# Altium schematic sheet AM3359_B.SchDoc
size A2
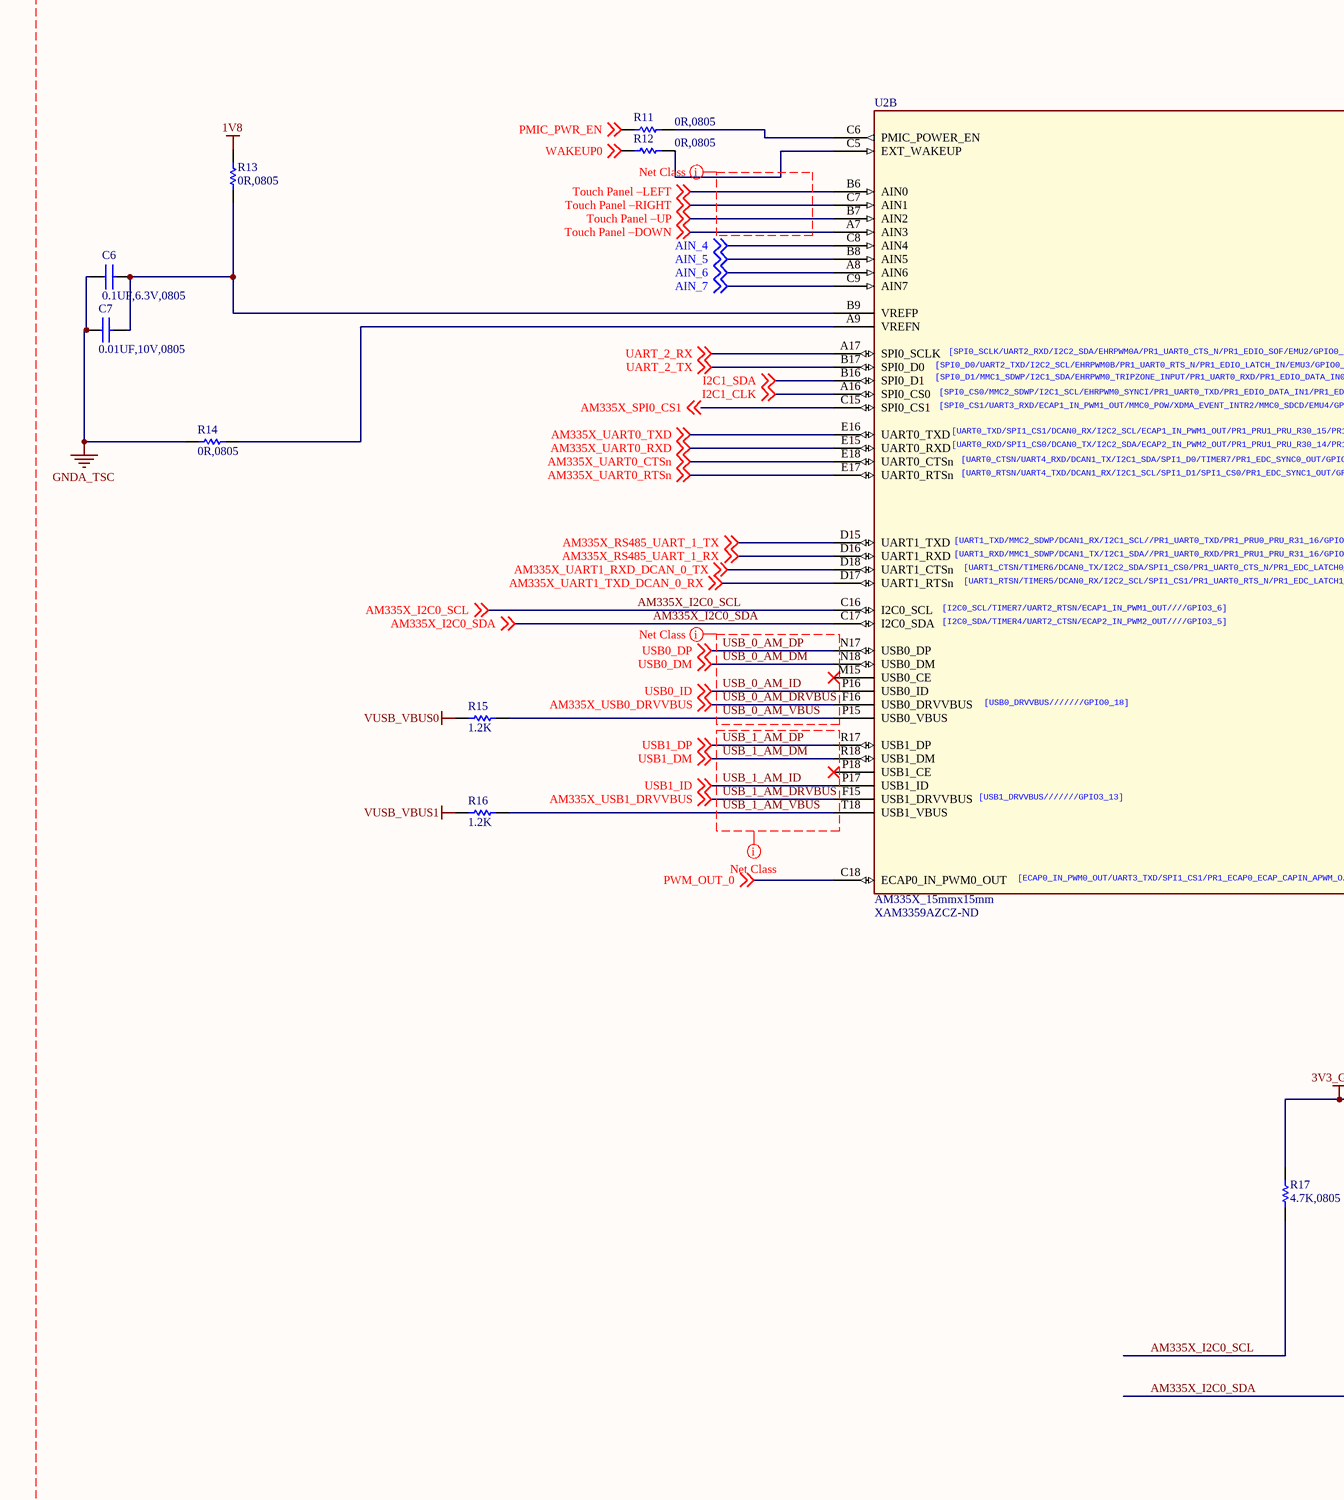
[diagram p0: AM3359_B.SchDoc, left]
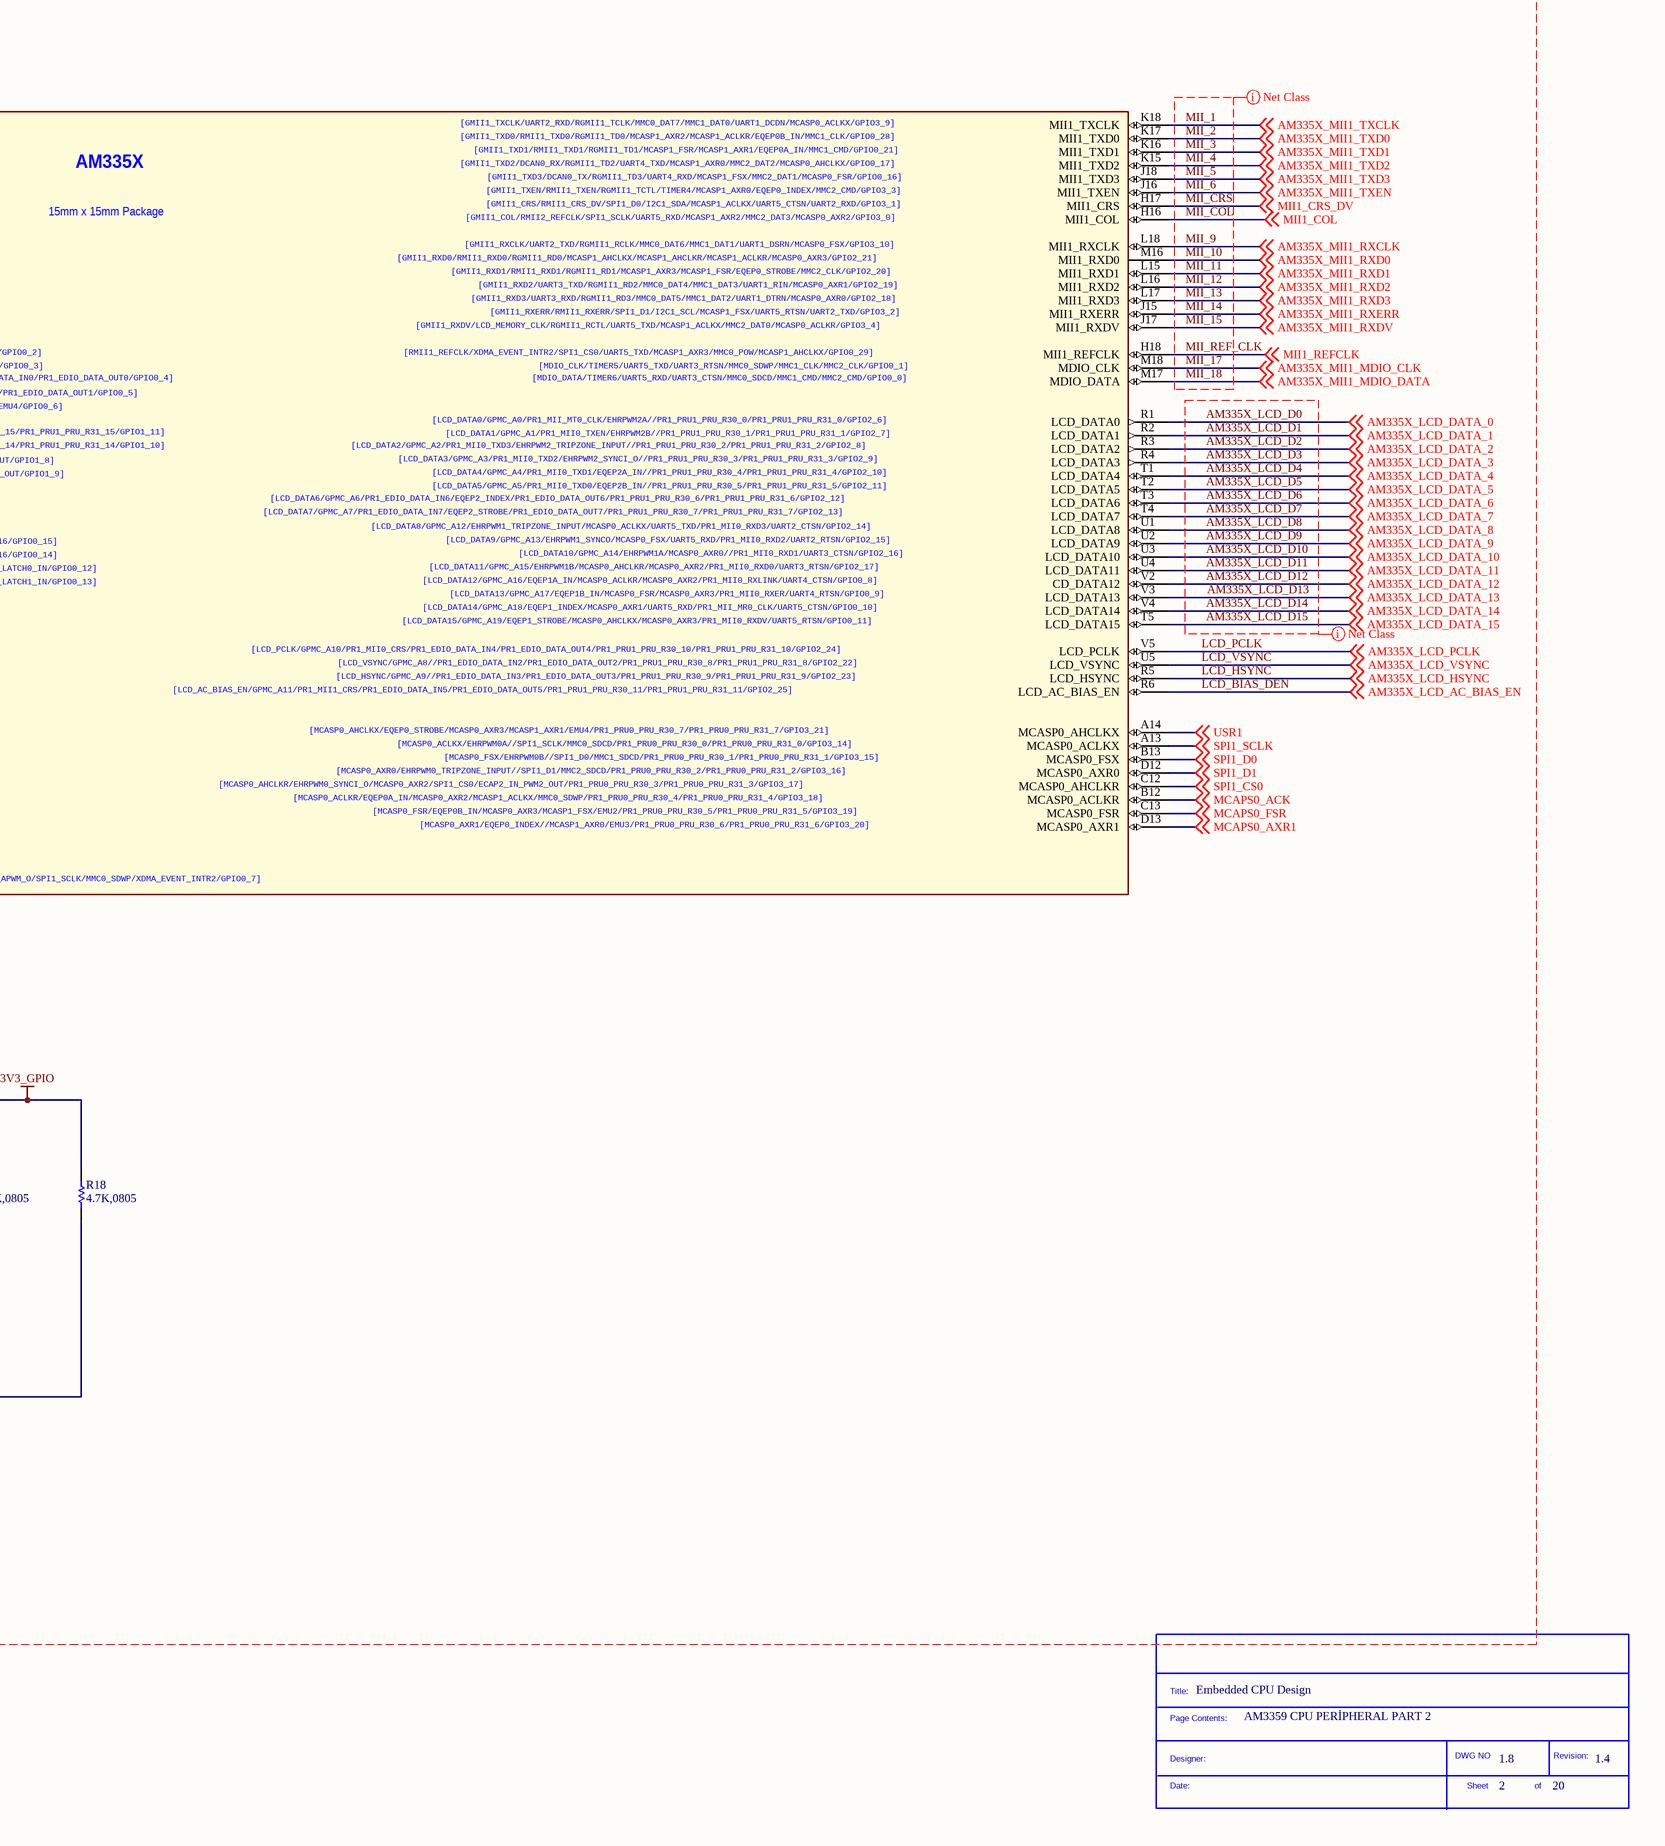
[diagram p1: AM3359_B.SchDoc, right]

## Parts
*?  SDTitleBlock  (value not drawn)  (graphical)
C6  0.1UF,6.3V,0805  [0402]
C7  0.01UF,10V,0805  [0402]
R11  0R,0805  [0402]
R12  0R,0805  [0402]
R13  0R,0805  [0402]
R14  0R,0805  [0402]
R15  1.2K  [0402]
R16  1.2K  [0402]
R17  4.7K,0805  [0402]
R18  4.7K,0805  [0402]
U2  AM335X_15mmx15mm  Supplier Part Number 1: XAM3359AZCZ-ND  [am33xx_15x15]  (part B of 3)

## Nets
1V8: R13.2
3V3_GPIO: R17.2 R18.2
GNDA_TSC: C6.1 C7.1 R14.2
VUSB_VBUS0: R15.1
VUSB_VBUS1: R16.1
AIN_4: U2.C8(AIN4) ; off-sheet AIN_4
AIN_5: U2.B8(AIN5) ; off-sheet AIN_5
AIN_6: U2.A8(AIN6) ; off-sheet AIN_6
AIN_7: U2.C9(AIN7) ; off-sheet AIN_7
AM335X_I2C0_SCL: R17.1 U2.C16(I2C0_SCL) ; off-sheet AM335X_I2C0_SCL
AM335X_I2C0_SDA: R18.1 U2.C17(I2C0_SDA) ; off-sheet AM335X_I2C0_SDA
AM335X_LCD_D0: U2.R1(LCD_DATA0) ; off-sheet AM335X_LCD_DATA_0  [also labelled AM335X_LCD_DATA_0]
AM335X_LCD_D1: U2.R2(LCD_DATA1) ; off-sheet AM335X_LCD_DATA_1  [also labelled AM335X_LCD_DATA_1]
AM335X_LCD_D2: U2.R3(LCD_DATA2) ; off-sheet AM335X_LCD_DATA_2  [also labelled AM335X_LCD_DATA_2]
AM335X_LCD_D3: U2.R4(LCD_DATA3) ; off-sheet AM335X_LCD_DATA_3  [also labelled AM335X_LCD_DATA_3]
AM335X_LCD_D4: U2.T1(LCD_DATA4) ; off-sheet AM335X_LCD_DATA_4  [also labelled AM335X_LCD_DATA_4]
AM335X_LCD_D5: U2.T2(LCD_DATA5) ; off-sheet AM335X_LCD_DATA_5  [also labelled AM335X_LCD_DATA_5]
AM335X_LCD_D6: U2.T3(LCD_DATA6) ; off-sheet AM335X_LCD_DATA_6  [also labelled AM335X_LCD_DATA_6]
AM335X_LCD_D7: U2.T4(LCD_DATA7) ; off-sheet AM335X_LCD_DATA_7  [also labelled AM335X_LCD_DATA_7]
AM335X_LCD_D8: U2.U1(LCD_DATA8) ; off-sheet AM335X_LCD_DATA_8  [also labelled AM335X_LCD_DATA_8]
AM335X_LCD_D9: U2.U2(LCD_DATA9) ; off-sheet AM335X_LCD_DATA_9  [also labelled AM335X_LCD_DATA_9]
AM335X_LCD_D10: U2.U3(LCD_DATA10) ; off-sheet AM335X_LCD_DATA_10  [also labelled AM335X_LCD_DATA_10]
AM335X_LCD_D11: U2.U4(LCD_DATA11) ; off-sheet AM335X_LCD_DATA_11  [also labelled AM335X_LCD_DATA_11]
AM335X_LCD_D12: U2.V2(CD_DATA12) ; off-sheet AM335X_LCD_DATA_12  [also labelled AM335X_LCD_DATA_12]
AM335X_LCD_D13: U2.V3(LCD_DATA13) ; off-sheet AM335X_LCD_DATA_13  [also labelled AM335X_LCD_DATA_13]
AM335X_LCD_D14: U2.V4(LCD_DATA14) ; off-sheet AM335X_LCD_DATA_14  [also labelled AM335X_LCD_DATA_14]
AM335X_LCD_D15: U2.T5(LCD_DATA15) ; off-sheet AM335X_LCD_DATA_15  [also labelled AM335X_LCD_DATA_15]
AM335X_RS485_UART_1_RX: U2.D16(UART1_RXD) ; off-sheet AM335X_RS485_UART_1_RX
AM335X_RS485_UART_1_TX: U2.D15(UART1_TXD) ; off-sheet AM335X_RS485_UART_1_TX
AM335X_SPI0_CS1: U2.C15(SPI0_CS1) ; off-sheet AM335X_SPI0_CS1
AM335X_UART0_CTSn: U2.E18(UART0_CTSn) ; off-sheet AM335X_UART0_CTSn
AM335X_UART0_RTSn: U2.E17(UART0_RTSn) ; off-sheet AM335X_UART0_RTSn
AM335X_UART0_RXD: U2.E15(UART0_RXD) ; off-sheet AM335X_UART0_RXD
AM335X_UART0_TXD: U2.E16(UART0_TXD) ; off-sheet AM335X_UART0_TXD
AM335X_UART1_RXD_DCAN_0_TX: U2.D18(UART1_CTSn) ; off-sheet AM335X_UART1_RXD_DCAN_0_TX
AM335X_UART1_TXD_DCAN_0_RX: U2.D17(UART1_RTSn) ; off-sheet AM335X_UART1_TXD_DCAN_0_RX
I2C1_CLK: U2.A16(SPI0_CS0) ; off-sheet I2C1_CLK
I2C1_SDA: U2.B16(SPI0_D1) ; off-sheet I2C1_SDA
LCD_BIAS_DEN: U2.R6(LCD_AC_BIAS_EN) ; off-sheet AM335X_LCD_AC_BIAS_EN  [also labelled AM335X_LCD_AC_BIAS_EN]
LCD_HSYNC: U2.R5(LCD_HSYNC) ; off-sheet AM335X_LCD_HSYNC  [also labelled AM335X_LCD_HSYNC]
LCD_PCLK: U2.V5(LCD_PCLK) ; off-sheet AM335X_LCD_PCLK  [also labelled AM335X_LCD_PCLK]
LCD_VSYNC: U2.U5(LCD_VSYNC) ; off-sheet AM335X_LCD_VSYNC  [also labelled AM335X_LCD_VSYNC]
MCAPS0_ACK: U2.B12(MCASP0_ACLKR) ; off-sheet MCAPS0_ACK
MCAPS0_AXR1: U2.D13(MCASP0_AXR1) ; off-sheet MCAPS0_AXR1
MCAPS0_FSR: U2.C13(MCASP0_FSR) ; off-sheet MCAPS0_FSR
MII_1: U2.K18(MII1_TXCLK) ; off-sheet AM335X_MII1_TXCLK  [also labelled AM335X_MII1_TXCLK]
MII_2: U2.K17(MII1_TXD0) ; off-sheet AM335X_MII1_TXD0  [also labelled AM335X_MII1_TXD0]
MII_3: U2.K16(MII1_TXD1) ; off-sheet AM335X_MII1_TXD1  [also labelled AM335X_MII1_TXD1]
MII_4: U2.K15(MII1_TXD2) ; off-sheet AM335X_MII1_TXD2  [also labelled AM335X_MII1_TXD2]
MII_5: U2.J18(MII1_TXD3) ; off-sheet AM335X_MII1_TXD3  [also labelled AM335X_MII1_TXD3]
MII_6: U2.J16(MII1_TXEN) ; off-sheet AM335X_MII1_TXEN  [also labelled AM335X_MII1_TXEN]
MII_9: U2.L18(MII1_RXCLK) ; off-sheet AM335X_MII1_RXCLK  [also labelled AM335X_MII1_RXCLK]
MII_10: U2.M16(MII1_RXD0) ; off-sheet AM335X_MII1_RXD0  [also labelled AM335X_MII1_RXD0]
MII_11: U2.L15(MII1_RXD1) ; off-sheet AM335X_MII1_RXD1  [also labelled AM335X_MII1_RXD1]
MII_12: U2.L16(MII1_RXD2) ; off-sheet AM335X_MII1_RXD2  [also labelled AM335X_MII1_RXD2]
MII_13: U2.L17(MII1_RXD3) ; off-sheet AM335X_MII1_RXD3  [also labelled AM335X_MII1_RXD3]
MII_14: U2.J15(MII1_RXERR) ; off-sheet AM335X_MII1_RXERR  [also labelled AM335X_MII1_RXERR]
MII_15: U2.J17(MII1_RXDV) ; off-sheet AM335X_MII1_RXDV  [also labelled AM335X_MII1_RXDV]
MII_17: U2.M18(MDIO_CLK) ; off-sheet AM335X_MII1_MDIO_CLK  [also labelled AM335X_MII1_MDIO_CLK]
MII_18: U2.M17(MDIO_DATA) ; off-sheet AM335X_MII1_MDIO_DATA  [also labelled AM335X_MII1_MDIO_DATA]
MII_COL: U2.H16(MII1_COL) ; off-sheet MII1_COL  [also labelled MII1_COL]
MII_CRS: U2.H17(MII1_CRS) ; off-sheet MII1_CRS_DV  [also labelled MII1_CRS_DV]
MII_REF_CLK: U2.H18(MII1_REFCLK) ; off-sheet MII1_REFCLK  [also labelled MII1_REFCLK]
PMIC_PWR_EN: R11.1 ; off-sheet PMIC_PWR_EN
PWM_OUT_0: U2.C18(ECAP0_IN_PWM0_OUT) ; off-sheet PWM_OUT_0
SPI1_CS0: U2.C12(MCASP0_AHCLKR) ; off-sheet SPI1_CS0
SPI1_D0: U2.B13(MCASP0_FSX) ; off-sheet SPI1_D0
SPI1_D1: U2.D12(MCASP0_AXR0) ; off-sheet SPI1_D1
SPI1_SCLK: U2.A13(MCASP0_ACLKX) ; off-sheet SPI1_SCLK
Touch Panel –DOWN: U2.A7(AIN3) ; off-sheet Touch Panel –DOWN
Touch Panel –LEFT: U2.B6(AIN0) ; off-sheet Touch Panel –LEFT
Touch Panel –RIGHT: U2.C7(AIN1) ; off-sheet Touch Panel –RIGHT
Touch Panel –UP: U2.B7(AIN2) ; off-sheet Touch Panel –UP
UART_2_RX: U2.A17(SPI0_SCLK) ; off-sheet UART_2_RX
UART_2_TX: U2.B17(SPI0_D0) ; off-sheet UART_2_TX
USB_0_AM_DM: U2.N18(USB0_DM) ; off-sheet USB0_DM  [also labelled USB0_DM]
USB_0_AM_DP: U2.N17(USB0_DP) ; off-sheet USB0_DP  [also labelled USB0_DP]
USB_0_AM_DRVBUS: U2.F16(USB0_DRVVBUS) ; off-sheet AM335X_USB0_DRVVBUS  [also labelled AM335X_USB0_DRVVBUS]
USB_0_AM_ID: U2.P16(USB0_ID) ; off-sheet USB0_ID  [also labelled USB0_ID]
USB_0_AM_VBUS: R15.2 U2.P15(USB0_VBUS)
USB_1_AM_DM: U2.R18(USB1_DM) ; off-sheet USB1_DM  [also labelled USB1_DM]
USB_1_AM_DP: U2.R17(USB1_DP) ; off-sheet USB1_DP  [also labelled USB1_DP]
USB_1_AM_DRVBUS: U2.F15(USB1_DRVVBUS) ; off-sheet AM335X_USB1_DRVVBUS  [also labelled AM335X_USB1_DRVVBUS]
USB_1_AM_ID: U2.P17(USB1_ID) ; off-sheet USB1_ID  [also labelled USB1_ID]
USB_1_AM_VBUS: R16.2 U2.T18(USB1_VBUS)
USR1: U2.A14(MCASP0_AHCLKX) ; off-sheet USR1
WAKEUP0: R12.1 ; off-sheet WAKEUP0
NetC6_2: C6.2 C7.2 R13.1 U2.B9(VREFP)
NetR11_2: R11.2 U2.C6(PMIC_POWER_EN)
NetR12_2: R12.2 U2.C5(EXT_WAKEUP)
NetR14_1: R14.1 U2.A9(VREFN)

Not connected (* = marked no-connect by the designer): U2 M15(USB0_CE)* P18(USB1_CE)*

## Layout directives
net class LCD_1: AM335X_LCD_D0, AM335X_LCD_D1, AM335X_LCD_D2, AM335X_LCD_D3, AM335X_LCD_D4, AM335X_LCD_D5, AM335X_LCD_D6, AM335X_LCD_D7, AM335X_LCD_D8, AM335X_LCD_D9, AM335X_LCD_D10, AM335X_LCD_D11, AM335X_LCD_D12, AM335X_LCD_D13, AM335X_LCD_D14, AM335X_LCD_D15
net class MII: MII_1, MII_2, MII_3, MII_4, MII_5, MII_6, MII_9, MII_10, MII_11, MII_12, MII_13, MII_14, MII_15, MII_17, MII_18, MII_COL, MII_CRS, MII_REF_CLK
net class AM335X_B: 1V8, 3V3_GPIO, AIN_4, AIN_5, AIN_6, AIN_7, AM335X_I2C0_SCL, AM335X_I2C0_SDA, AM335X_LCD_AC_BIAS_EN, AM335X_LCD_D0, AM335X_LCD_D1, AM335X_LCD_D2, AM335X_LCD_D3, AM335X_LCD_D4, AM335X_LCD_D5, AM335X_LCD_D6, AM335X_LCD_D7, AM335X_LCD_D8, AM335X_LCD_D9, AM335X_LCD_D10, AM335X_LCD_D11, AM335X_LCD_D12, AM335X_LCD_D13, AM335X_LCD_D14, AM335X_LCD_D15, AM335X_LCD_DATA_0, AM335X_LCD_DATA_1, AM335X_LCD_DATA_2, AM335X_LCD_DATA_3, AM335X_LCD_DATA_4, AM335X_LCD_DATA_5, AM335X_LCD_DATA_6, AM335X_LCD_DATA_7, AM335X_LCD_DATA_8, AM335X_LCD_DATA_9, AM335X_LCD_DATA_10, AM335X_LCD_DATA_11, AM335X_LCD_DATA_12, AM335X_LCD_DATA_13, AM335X_LCD_DATA_14, AM335X_LCD_DATA_15, AM335X_LCD_HSYNC, AM335X_LCD_PCLK, AM335X_LCD_VSYNC, AM335X_MII1_MDIO_CLK, AM335X_MII1_MDIO_DATA, AM335X_MII1_RXCLK, AM335X_MII1_RXD0, AM335X_MII1_RXD1, AM335X_MII1_RXD2, AM335X_MII1_RXD3, AM335X_MII1_RXDV, AM335X_MII1_RXERR, AM335X_MII1_TXCLK, AM335X_MII1_TXD0, AM335X_MII1_TXD1, AM335X_MII1_TXD2, AM335X_MII1_TXD3, AM335X_MII1_TXEN, AM335X_RS485_UART_1_RX, AM335X_RS485_UART_1_TX, AM335X_SPI0_CS1, AM335X_UART0_CTSn, AM335X_UART0_RTSn, AM335X_UART0_RXD, AM335X_UART0_TXD, AM335X_UART1_RXD_DCAN_0_TX, AM335X_UART1_TXD_DCAN_0_RX, AM335X_USB0_DRVVBUS, AM335X_USB1_DRVVBUS, GNDA_TSC, I2C1_CLK, I2C1_SDA, LCD_BIAS_DEN, LCD_HSYNC, LCD_PCLK, LCD_VSYNC, MCAPS0_ACK, MCAPS0_AXR1, MCAPS0_FSR, MII1_COL, MII1_CRS_DV, MII1_REFCLK, MII_1, MII_2, MII_3, MII_4, MII_5, MII_6, MII_9, MII_10, MII_11, MII_12, MII_13, MII_14, MII_15, MII_17, MII_18, MII_COL, MII_CRS, MII_REF_CLK, PMIC_PWR_EN, PWM_OUT_0, SPI1_CS0, SPI1_D0, SPI1_D1, SPI1_SCLK, Touch Panel –DOWN, Touch Panel –LEFT, Touch Panel –RIGHT, Touch Panel –UP, UART_2_RX, UART_2_TX, USB0_DM, USB0_DP, USB0_ID, USB1_DM, USB1_DP, USB1_ID, USB_0_AM_DM, USB_0_AM_DP, USB_0_AM_DRVBUS, USB_0_AM_ID, USB_0_AM_VBUS, USB_1_AM_DM, USB_1_AM_DP, USB_1_AM_DRVBUS, USB_1_AM_ID, USB_1_AM_VBUS, USR1, VUSB_VBUS0, VUSB_VBUS1, WAKEUP0
net class USB_0_AMX: 1V8, 3V3_GPIO, AIN_4, AIN_5, AIN_6, AIN_7, AM335X_I2C0_SCL, AM335X_I2C0_SDA, AM335X_LCD_AC_BIAS_EN, AM335X_LCD_D0, AM335X_LCD_D1, AM335X_LCD_D2, AM335X_LCD_D3, AM335X_LCD_D4, AM335X_LCD_D5, AM335X_LCD_D6, AM335X_LCD_D7, AM335X_LCD_D8, AM335X_LCD_D9, AM335X_LCD_D10, AM335X_LCD_D11, AM335X_LCD_D12, AM335X_LCD_D13, AM335X_LCD_D14, AM335X_LCD_D15, AM335X_LCD_DATA_0, AM335X_LCD_DATA_1, AM335X_LCD_DATA_2, AM335X_LCD_DATA_3, AM335X_LCD_DATA_4, AM335X_LCD_DATA_5, AM335X_LCD_DATA_6, AM335X_LCD_DATA_7, AM335X_LCD_DATA_8, AM335X_LCD_DATA_9, AM335X_LCD_DATA_10, AM335X_LCD_DATA_11, AM335X_LCD_DATA_12, AM335X_LCD_DATA_13, AM335X_LCD_DATA_14, AM335X_LCD_DATA_15, AM335X_LCD_HSYNC, AM335X_LCD_PCLK, AM335X_LCD_VSYNC, AM335X_MII1_MDIO_CLK, AM335X_MII1_MDIO_DATA, AM335X_MII1_RXCLK, AM335X_MII1_RXD0, AM335X_MII1_RXD1, AM335X_MII1_RXD2, AM335X_MII1_RXD3, AM335X_MII1_RXDV, AM335X_MII1_RXERR, AM335X_MII1_TXCLK, AM335X_MII1_TXD0, AM335X_MII1_TXD1, AM335X_MII1_TXD2, AM335X_MII1_TXD3, AM335X_MII1_TXEN, AM335X_RS485_UART_1_RX, AM335X_RS485_UART_1_TX, AM335X_SPI0_CS1, AM335X_UART0_CTSn, AM335X_UART0_RTSn, AM335X_UART0_RXD, AM335X_UART0_TXD, AM335X_UART1_RXD_DCAN_0_TX, AM335X_UART1_TXD_DCAN_0_RX, AM335X_USB0_DRVVBUS, AM335X_USB1_DRVVBUS, GNDA_TSC, I2C1_CLK, I2C1_SDA, LCD_BIAS_DEN, LCD_HSYNC, LCD_PCLK, LCD_VSYNC, MCAPS0_ACK, MCAPS0_AXR1, MCAPS0_FSR, MII1_COL, MII1_CRS_DV, MII1_REFCLK, MII_1, MII_2, MII_3, MII_4, MII_5, MII_6, MII_9, MII_10, MII_11, MII_12, MII_13, MII_14, MII_15, MII_17, MII_18, MII_COL, MII_CRS, MII_REF_CLK, PMIC_PWR_EN, PWM_OUT_0, SPI1_CS0, SPI1_D0, SPI1_D1, SPI1_SCLK, Touch Panel –DOWN, Touch Panel –LEFT, Touch Panel –RIGHT, Touch Panel –UP, UART_2_RX, UART_2_TX, USB0_DM, USB0_DP, USB0_ID, USB1_DM, USB1_DP, USB1_ID, USB_0_AM_DM, USB_0_AM_DP, USB_0_AM_DRVBUS, USB_0_AM_ID, USB_0_AM_VBUS, USB_1_AM_DM, USB_1_AM_DP, USB_1_AM_DRVBUS, USB_1_AM_ID, USB_1_AM_VBUS, USR1, VUSB_VBUS0, VUSB_VBUS1, WAKEUP0
net class USB_1_AMX: 1V8, 3V3_GPIO, AIN_4, AIN_5, AIN_6, AIN_7, AM335X_I2C0_SCL, AM335X_I2C0_SDA, AM335X_LCD_AC_BIAS_EN, AM335X_LCD_D0, AM335X_LCD_D1, AM335X_LCD_D2, AM335X_LCD_D3, AM335X_LCD_D4, AM335X_LCD_D5, AM335X_LCD_D6, AM335X_LCD_D7, AM335X_LCD_D8, AM335X_LCD_D9, AM335X_LCD_D10, AM335X_LCD_D11, AM335X_LCD_D12, AM335X_LCD_D13, AM335X_LCD_D14, AM335X_LCD_D15, AM335X_LCD_DATA_0, AM335X_LCD_DATA_1, AM335X_LCD_DATA_2, AM335X_LCD_DATA_3, AM335X_LCD_DATA_4, AM335X_LCD_DATA_5, AM335X_LCD_DATA_6, AM335X_LCD_DATA_7, AM335X_LCD_DATA_8, AM335X_LCD_DATA_9, AM335X_LCD_DATA_10, AM335X_LCD_DATA_11, AM335X_LCD_DATA_12, AM335X_LCD_DATA_13, AM335X_LCD_DATA_14, AM335X_LCD_DATA_15, AM335X_LCD_HSYNC, AM335X_LCD_PCLK, AM335X_LCD_VSYNC, AM335X_MII1_MDIO_CLK, AM335X_MII1_MDIO_DATA, AM335X_MII1_RXCLK, AM335X_MII1_RXD0, AM335X_MII1_RXD1, AM335X_MII1_RXD2, AM335X_MII1_RXD3, AM335X_MII1_RXDV, AM335X_MII1_RXERR, AM335X_MII1_TXCLK, AM335X_MII1_TXD0, AM335X_MII1_TXD1, AM335X_MII1_TXD2, AM335X_MII1_TXD3, AM335X_MII1_TXEN, AM335X_RS485_UART_1_RX, AM335X_RS485_UART_1_TX, AM335X_SPI0_CS1, AM335X_UART0_CTSn, AM335X_UART0_RTSn, AM335X_UART0_RXD, AM335X_UART0_TXD, AM335X_UART1_RXD_DCAN_0_TX, AM335X_UART1_TXD_DCAN_0_RX, AM335X_USB0_DRVVBUS, AM335X_USB1_DRVVBUS, GNDA_TSC, I2C1_CLK, I2C1_SDA, LCD_BIAS_DEN, LCD_HSYNC, LCD_PCLK, LCD_VSYNC, MCAPS0_ACK, MCAPS0_AXR1, MCAPS0_FSR, MII1_COL, MII1_CRS_DV, MII1_REFCLK, MII_1, MII_2, MII_3, MII_4, MII_5, MII_6, MII_9, MII_10, MII_11, MII_12, MII_13, MII_14, MII_15, MII_17, MII_18, MII_COL, MII_CRS, MII_REF_CLK, PMIC_PWR_EN, PWM_OUT_0, SPI1_CS0, SPI1_D0, SPI1_D1, SPI1_SCLK, Touch Panel –DOWN, Touch Panel –LEFT, Touch Panel –RIGHT, Touch Panel –UP, UART_2_RX, UART_2_TX, USB0_DM, USB0_DP, USB0_ID, USB1_DM, USB1_DP, USB1_ID, USB_0_AM_DM, USB_0_AM_DP, USB_0_AM_DRVBUS, USB_0_AM_ID, USB_0_AM_VBUS, USB_1_AM_DM, USB_1_AM_DP, USB_1_AM_DRVBUS, USB_1_AM_ID, USB_1_AM_VBUS, USR1, VUSB_VBUS0, VUSB_VBUS1, WAKEUP0
net class TOUCH: 1V8, 3V3_GPIO, AIN_4, AIN_5, AIN_6, AIN_7, AM335X_I2C0_SCL, AM335X_I2C0_SDA, AM335X_LCD_AC_BIAS_EN, AM335X_LCD_D0, AM335X_LCD_D1, AM335X_LCD_D2, AM335X_LCD_D3, AM335X_LCD_D4, AM335X_LCD_D5, AM335X_LCD_D6, AM335X_LCD_D7, AM335X_LCD_D8, AM335X_LCD_D9, AM335X_LCD_D10, AM335X_LCD_D11, AM335X_LCD_D12, AM335X_LCD_D13, AM335X_LCD_D14, AM335X_LCD_D15, AM335X_LCD_DATA_0, AM335X_LCD_DATA_1, AM335X_LCD_DATA_2, AM335X_LCD_DATA_3, AM335X_LCD_DATA_4, AM335X_LCD_DATA_5, AM335X_LCD_DATA_6, AM335X_LCD_DATA_7, AM335X_LCD_DATA_8, AM335X_LCD_DATA_9, AM335X_LCD_DATA_10, AM335X_LCD_DATA_11, AM335X_LCD_DATA_12, AM335X_LCD_DATA_13, AM335X_LCD_DATA_14, AM335X_LCD_DATA_15, AM335X_LCD_HSYNC, AM335X_LCD_PCLK, AM335X_LCD_VSYNC, AM335X_MII1_MDIO_CLK, AM335X_MII1_MDIO_DATA, AM335X_MII1_RXCLK, AM335X_MII1_RXD0, AM335X_MII1_RXD1, AM335X_MII1_RXD2, AM335X_MII1_RXD3, AM335X_MII1_RXDV, AM335X_MII1_RXERR, AM335X_MII1_TXCLK, AM335X_MII1_TXD0, AM335X_MII1_TXD1, AM335X_MII1_TXD2, AM335X_MII1_TXD3, AM335X_MII1_TXEN, AM335X_RS485_UART_1_RX, AM335X_RS485_UART_1_TX, AM335X_SPI0_CS1, AM335X_UART0_CTSn, AM335X_UART0_RTSn, AM335X_UART0_RXD, AM335X_UART0_TXD, AM335X_UART1_RXD_DCAN_0_TX, AM335X_UART1_TXD_DCAN_0_RX, AM335X_USB0_DRVVBUS, AM335X_USB1_DRVVBUS, GNDA_TSC, I2C1_CLK, I2C1_SDA, LCD_BIAS_DEN, LCD_HSYNC, LCD_PCLK, LCD_VSYNC, MCAPS0_ACK, MCAPS0_AXR1, MCAPS0_FSR, MII1_COL, MII1_CRS_DV, MII1_REFCLK, MII_1, MII_2, MII_3, MII_4, MII_5, MII_6, MII_9, MII_10, MII_11, MII_12, MII_13, MII_14, MII_15, MII_17, MII_18, MII_COL, MII_CRS, MII_REF_CLK, PMIC_PWR_EN, PWM_OUT_0, SPI1_CS0, SPI1_D0, SPI1_D1, SPI1_SCLK, Touch Panel –DOWN, Touch Panel –LEFT, Touch Panel –RIGHT, Touch Panel –UP, UART_2_RX, UART_2_TX, USB0_DM, USB0_DP, USB0_ID, USB1_DM, USB1_DP, USB1_ID, USB_0_AM_DM, USB_0_AM_DP, USB_0_AM_DRVBUS, USB_0_AM_ID, USB_0_AM_VBUS, USB_1_AM_DM, USB_1_AM_DP, USB_1_AM_DRVBUS, USB_1_AM_ID, USB_1_AM_VBUS, USR1, VUSB_VBUS0, VUSB_VBUS1, WAKEUP0

## Notes on the sheet
- Embedded CPU Design
- AM3359 CPU PERİPHERAL PART 2
- 2
- 1.8
- 20
- 1.4
- (in symbol AM335X_15mmx15mm, part B) [GMII1_TXCLK/UART2_RXD/RGMII1_TCLK/MMC0_DAT7/MMC1_DAT0/UART1_DCDN/MCASP0_ACLKX/GPIO3_9]; [GMII1_TXD0/RMII1_TXD0/RGMII1_TD0/MCASP1_AXR2/MCASP1_ACLKR/EQEP0B_IN/MMC1_CLK/GPIO0_28]; [GMII1_TXD1/RMII1_TXD1/RGMII1_TD1/MCASP1_FSR/MCASP1_AXR1/EQEP0A_IN/MMC1_CMD/GPIO0_21]; AM335X; [GMII1_TXD2/DCAN0_RX/RGMII1_TD2/UART4_TXD/MCASP1_AXR0/MMC2_DAT2/MCASP0_AHCLKX/GPIO0_17]; [GMII1_TXD3/DCAN0_TX/RGMII1_TD3/UART4_RXD/MCASP1_FSX/MMC2_DAT1/MCASP0_FSR/GPIO0_16]; [GMII1_TXEN/RMII1_TXEN/RGMII1_TCTL/TIMER4/MCASP1_AXR0/EQEP0_INDEX/MMC2_CMD/GPIO3_3]; [GMII1_CRS/RMII1_CRS_DV/SPI1_D0/I2C1_SDA/MCASP1_ACLKX/UART5_CTSN/UART2_RXD/GPIO3_1]; 15mm x 15mm Package; [GMII1_COL/RMII2_REFCLK/SPI1_SCLK/UART5_RXD/MCASP1_AXR2/MMC2_DAT3/MCASP0_AXR2/GPIO3_0]; [GMII1_RXCLK/UART2_TXD/RGMII1_RCLK/MMC0_DAT6/MMC1_DAT1/UART1_DSRN/MCASP0_FSX/GPIO3_10]; [GMII1_RXD0/RMII1_RXD0/RGMII1_RD0/MCASP1_AHCLKX/MCASP1_AHCLKR/MCASP1_ACLKR/MCASP0_AXR3/GPIO2_21]; [GMII1_RXD1/RMII1_RXD1/RGMII1_RD1/MCASP1_AXR3/MCASP1_FSR/EQEP0_STROBE/MMC2_CLK/GPIO2_20]; [GMII1_RXD2/UART3_TXD/RGMII1_RD2/MMC0_DAT4/MMC1_DAT3/UART1_RIN/MCASP0_AXR1/GPIO2_19]; [GMII1_RXD3/UART3_RXD/RGMII1_RD3/MMC0_DAT5/MMC1_DAT2/UART1_DTRN/MCASP0_AXR0/GPIO2_18]; [GMII1_RXERR/RMII1_RXERR/SPI1_D1/I2C1_SCL/MCASP1_FSX/UART5_RTSN/UART2_TXD/GPIO3_2]; [GMII1_RXDV/LCD_MEMORY_CLK/RGMII1_RCTL/UART5_TXD/MCASP1_ACLKX/MMC2_DAT0/MCASP0_ACLKR/GPIO3_4]; [SPI0_SCLK/UART2_RXD/I2C2_SDA/EHRPWM0A/PR1_UART0_CTS_N/PR1_EDIO_SOF/EMU2/GPIO0_2]; [RMII1_REFCLK/XDMA_EVENT_INTR2/SPI1_CS0/UART5_TXD/MCASP1_AXR3/MMC0_POW/MCASP1_AHCLKX/GPIO0_29]; [SPI0_D0/UART2_TXD/I2C2_SCL/EHRPWM0B/PR1_UART0_RTS_N/PR1_EDIO_LATCH_IN/EMU3/GPIO0_3]; [MDIO_CLK/TIMER5/UART5_TXD/UART3_RTSN/MMC0_SDWP/MMC1_CLK/MMC2_CLK/GPIO0_1]; [SPI0_D1/MMC1_SDWP/I2C1_SDA/EHRPWM0_TRIPZONE_INPUT/PR1_UART0_RXD/PR1_EDIO_DATA_IN0/PR1_EDIO_DATA_OUT0/GPIO0_4]; [MDIO_DATA/TIMER6/UART5_RXD/UART3_CTSN/MMC0_SDCD/MMC1_CMD/MMC2_CMD/GPIO0_0]; [SPI0_CS0/MMC2_SDWP/I2C1_SCL/EHRPWM0_SYNCI/PR1_UART0_TXD/PR1_EDIO_DATA_IN1/PR1_EDIO_DATA_OUT1/GPIO0_5]; [SPI0_CS1/UART3_RXD/ECAP1_IN_PWM1_OUT/MMC0_POW/XDMA_EVENT_INTR2/MMC0_SDCD/EMU4/GPIO0_6]; [LCD_DATA0/GPMC_A0/PR1_MII_MT0_CLK/EHRPWM2A//PR1_PRU1_PRU_R30_0/PR1_PRU1_PRU_R31_0/GPIO2_6]; [UART0_TXD/SPI1_CS1/DCAN0_RX/I2C2_SCL/ECAP1_IN_PWM1_OUT/PR1_PRU1_PRU_R30_15/PR1_PRU1_PRU_R31_15/GPIO1_11]; [LCD_DATA1/GPMC_A1/PR1_MII0_TXEN/EHRPWM2B//PR1_PRU1_PRU_R30_1/PR1_PRU1_PRU_R31_1/GPIO2_7]; [UART0_RXD/SPI1_CS0/DCAN0_TX/I2C2_SDA/ECAP2_IN_PWM2_OUT/PR1_PRU1_PRU_R30_14/PR1_PRU1_PRU_R31_14/GPIO1_10]; [LCD_DATA2/GPMC_A2/PR1_MII0_TXD3/EHRPWM2_TRIPZONE_INPUT//PR1_PRU1_PRU_R30_2/PR1_PRU1_PRU_R31_2/GPIO2_8]; [LCD_DATA3/GPMC_A3/PR1_MII0_TXD2/EHRPWM2_SYNCI_O//PR1_PRU1_PRU_R30_3/PR1_PRU1_PRU_R31_3/GPIO2_9]; [UART0_CTSN/UART4_RXD/DCAN1_TX/I2C1_SDA/SPI1_D0/TIMER7/PR1_EDC_SYNC0_OUT/GPIO1_8]; [LCD_DATA4/GPMC_A4/PR1_MII0_TXD1/EQEP2A_IN//PR1_PRU1_PRU_R30_4/PR1_PRU1_PRU_R31_4/GPIO2_10]; [UART0_RTSN/UART4_TXD/DCAN1_RX/I2C1_SCL/SPI1_D1/SPI1_CS0/PR1_EDC_SYNC1_OUT/GPIO1_9]; [LCD_DATA5/GPMC_A5/PR1_MII0_TXD0/EQEP2B_IN//PR1_PRU1_PRU_R30_5/PR1_PRU1_PRU_R31_5/GPIO2_11]; [LCD_DATA6/GPMC_A6/PR1_EDIO_DATA_IN6/EQEP2_INDEX/PR1_EDIO_DATA_OUT6/PR1_PRU1_PRU_R30_6/PR1_PRU1_PRU_R31_6/GPIO2_12]; [LCD_DATA7/GPMC_A7/PR1_EDIO_DATA_IN7/EQEP2_STROBE/PR1_EDIO_DATA_OUT7/PR1_PRU1_PRU_R30_7/PR1_PRU1_PRU_R31_7/GPIO2_13]; [LCD_DATA8/GPMC_A12/EHRPWM1_TRIPZONE_INPUT/MCASP0_ACLKX/UART5_TXD/PR1_MII0_RXD3/UART2_CTSN/GPIO2_14]; [LCD_DATA9/GPMC_A13/EHRPWM1_SYNCO/MCASP0_FSX/UART5_RXD/PR1_MII0_RXD2/UART2_RTSN/GPIO2_15]; [UART1_TXD/MMC2_SDWP/DCAN1_RX/I2C1_SCL//PR1_UART0_TXD/PR1_PRU0_PRU_R31_16/GPIO0_15]; [LCD_DATA10/GPMC_A14/EHRPWM1A/MCASP0_AXR0//PR1_MII0_RXD1/UART3_CTSN/GPIO2_16]; [UART1_RXD/MMC1_SDWP/DCAN1_TX/I2C1_SDA//PR1_UART0_RXD/PR1_PRU1_PRU_R31_16/GPIO0_14]; [LCD_DATA11/GPMC_A15/EHRPWM1B/MCASP0_AHCLKR/MCASP0_AXR2/PR1_MII0_RXD0/UART3_RTSN/GPIO2_17]; [UART1_CTSN/TIMER6/DCAN0_TX/I2C2_SDA/SPI1_CS0/PR1_UART0_CTS_N/PR1_EDC_LATCH0_IN/GPIO0_12]; [LCD_DATA12/GPMC_A16/EQEP1A_IN/MCASP0_ACLKR/MCASP0_AXR2/PR1_MII0_RXLINK/UART4_CTSN/GPIO0_8]; [UART1_RTSN/TIMER5/DCAN0_RX/I2C2_SCL/SPI1_CS1/PR1_UART0_RTS_N/PR1_EDC_LATCH1_IN/GPIO0_13]; [LCD_DATA13/GPMC_A17/EQEP1B_IN/MCASP0_FSR/MCASP0_AXR3/PR1_MII0_RXER/UART4_RTSN/GPIO0_9]; [LCD_DATA14/GPMC_A18/EQEP1_INDEX/MCASP0_AXR1/UART5_RXD/PR1_MII_MR0_CLK/UART5_CTSN/GPIO0_10]; [I2C0_SCL/TIMER7/UART2_RTSN/ECAP1_IN_PWM1_OUT////GPIO3_6]; [LCD_DATA15/GPMC_A19/EQEP1_STROBE/MCASP0_AHCLKX/MCASP0_AXR3/PR1_MII0_RXDV/UART5_RTSN/GPIO0_11]; [I2C0_SDA/TIMER4/UART2_CTSN/ECAP2_IN_PWM2_OUT////GPIO3_5]; [LCD_PCLK/GPMC_A10/PR1_MII0_CRS/PR1_EDIO_DATA_IN4/PR1_EDIO_DATA_OUT4/PR1_PRU1_PRU_R30_10/PR1_PRU1_PRU_R31_10/GPIO2_24]; [LCD_VSYNC/GPMC_A8//PR1_EDIO_DATA_IN2/PR1_EDIO_DATA_OUT2/PR1_PRU1_PRU_R30_8/PR1_PRU1_PRU_R31_8/GPIO2_22]; [LCD_HSYNC/GPMC_A9//PR1_EDIO_DATA_IN3/PR1_EDIO_DATA_OUT3/PR1_PRU1_PRU_R30_9/PR1_PRU1_PRU_R31_9/GPIO2_23]; [LCD_AC_BIAS_EN/GPMC_A11/PR1_MII1_CRS/PR1_EDIO_DATA_IN5/PR1_EDIO_DATA_OUT5/PR1_PRU1_PRU_R30_11/PR1_PRU1_PRU_R31_11/GPIO2_25]; [USB0_DRVVBUS///////GPIO0_18]; [MCASP0_AHCLKX/EQEP0_STROBE/MCASP0_AXR3/MCASP1_AXR1/EMU4/PR1_PRU0_PRU_R30_7/PR1_PRU0_PRU_R31_7/GPIO3_21]; [MCASP0_ACLKX/EHRPWM0A//SPI1_SCLK/MMC0_SDCD/PR1_PRU0_PRU_R30_0/PR1_PRU0_PRU_R31_0/GPIO3_14]; [MCASP0_FSX/EHRPWM0B//SPI1_D0/MMC1_SDCD/PR1_PRU0_PRU_R30_1/PR1_PRU0_PRU_R31_1/GPIO3_15]; [MCASP0_AXR0/EHRPWM0_TRIPZONE_INPUT//SPI1_D1/MMC2_SDCD/PR1_PRU0_PRU_R30_2/PR1_PRU0_PRU_R31_2/GPIO3_16]; [MCASP0_AHCLKR/EHRPWM0_SYNCI_O/MCASP0_AXR2/SPI1_CS0/ECAP2_IN_PWM2_OUT/PR1_PRU0_PRU_R30_3/PR1_PRU0_PRU_R31_3/GPIO3_17]; [USB1_DRVVBUS///////GPIO3_13]; [MCASP0_ACLKR/EQEP0A_IN/MCASP0_AXR2/MCASP1_ACLKX/MMC0_SDWP/PR1_PRU0_PRU_R30_4/PR1_PRU0_PRU_R31_4/GPIO3_18]; [MCASP0_FSR/EQEP0B_IN/MCASP0_AXR3/MCASP1_FSX/EMU2/PR1_PRU0_PRU_R30_5/PR1_PRU0_PRU_R31_5/GPIO3_19]; [MCASP0_AXR1/EQEP0_INDEX//MCASP1_AXR0/EMU3/PR1_PRU0_PRU_R30_6/PR1_PRU0_PRU_R31_6/GPIO3_20]; [ECAP0_IN_PWM0_OUT/UART3_TXD/SPI1_CS1/PR1_ECAP0_ECAP_CAPIN_APWM_O/SPI1_SCLK/MMC0_SDWP/XDMA_EVENT_INTR2/GPIO0_7]
- (in symbol SDTitleBlock) Title:; Page Contents:; Designer:; DWG NO; Revision:; Date:; Sheet; of

## Library data of the parts
C6 = 0.1UF,6.3V,0805: CAP CER 0.1UF 6.3V 10% X7R 0805; Manufacturer: Kemet; Manufacturer Part Number: C0805C104K9RACTU; Capacitance: 0.1µF; Supplier 1: Digi-Key; RoHS: RoHS Compliant; Category: Capacitors; Stock 1: 19204; Pricing 1: 1=0.12, 10=0.083, 25=0.062, 50=0.0476, 100=0.0392, 250=0.03304, 1000=0.02228 (USD); Packaging: Digi-Reel®; Tolerance: ±10%; Voltage - Rated: 6.3V; Temperature Coefficient: X7R; Mounting Type: Surface Mount, MLCC; Operating Temperature: -55°C ~ 125°C; Applications: General Purpose; Ratings: -; Package / Case: 0805 (2012 Metric); Size / Dimension: 0.079" L x 0.049" W (2.00mm x 1.25mm); Height - Seated (Max): -; Thickness (Max): 0.035" (0.88mm); Lead Spacing: -; Features: -; Lead Style: -; ComponentLink1URL: http://www.kemet.com/docfinder?Partnumber=C0805C104K9RACTU; ComponentLink1Description: http://www.kemet.com/docfinder?Partnumber=C0805C104K9RACTU; Supplier Part Number 1: 399-9155-6-ND
C7 = 0.01UF,10V,0805: MULTICOMP - MCSH21B103K100CT - CAP, MLCC, X7R, 10NF, 10V, 0805; Capacitance: 10000pF; Tolerance: ±10%; Voltage - Rated: 16V; Supplier 1: Digi-Key; Manufacturer: MULTICOMP; Manufacturer Part Number: MCSH21B103K100CT; RoHS: YES; Stock 1: 21284; Pricing 1: 1=0.24, 10=0.2, 50=0.1126, 100=0.1, 250=0.075, 500=0.06626, 1000=0.05875 (USD); ComponentLink1URL: http://www.farnell.com/datasheets/1825494.pdf; ComponentLink1Description: http://www.farnell.com/datasheets/1825494.pdf; Supplier Part Number 1: 399-7995-1-ND; Category: Capacitors; Packaging: Cut Tape (CT); Temperature Coefficient: X7R; Mounting Type: Surface Mount, MLCC; Operating Temperature: -55°C ~ 125°C; Applications: General Purpose; Ratings: -; Package / Case: 0805 (2012 Metric); Size / Dimension: 0.079" L x 0.049" W (2.00mm x 1.25mm); Height - Seated (Max): -; Thickness (Max): 0.035" (0.88mm); Lead Spacing: -; Features: -; Lead Style: -; ComponentLink2URL: http://www.kemet.com/docfinder?Partnumber=C0805C103K4RACTU; ComponentLink2Description: http://www.kemet.com/docfinder?Partnumber=C0805C103K4RACTU
R11-R14 = 0R,0805: BOURNS - CR0805-J/-000ELF - RESISTOR, 0805, 0R, 5%, 1/8W; Product Range: BOURNS - CR Series; Resistance: 0; Power Rating: 125; Resistor Case Style: 0805 [2012 Metric]; Resistor Element Material: Thick Film; Temperature Coefficient: -250ppm/°C to +500; Voltage Rating: 150; SVHC: No SVHC (16-Jun-2014); Resistor Mounting: SMD<!--FANDB--><div class="features-and-benefits-container"></div>; Connector Type: RJ45; Number of Ports: 1; LED Color: Green - Yellow; Number of Cores per Jack: 6; Shielding: Shielded, EMI Finger; Tab Direction: Up; Shield Material: Brass; Resistance (Ohms): 0.0; Tolerance: Jumper; Power (Watts): 0.125W, 1/8W; Manufacturer: BOURNS; Manufacturer Part Number: CR0805-J/-000ELF; RoHS: YES; Resistance Tolerance: ± 5%; Packaging: Cut Tape; MSL: MSL 1 - Unlimited; ComponentLink1URL: http://www.farnell.com/datasheets/1845293.pdf; ComponentLink1Description: http://www.farnell.com/datasheets/1845293.pdf; Category: Connectors, Interconnects; Number of Rows: 1; Applications: 10/100 Base-T, AutoMDIX; Mounting Type: Through Hole; Orientation: 90° Angle (Right); Termination: Solder; Height Above Board: 0.555" (14.10mm); Features: Board Lock, Decoupling Capacitance; Contact Material: Phosphor Bronze; Contact Finish: Gold; Contact Finish Thickness: 50µin (1.27µm); Housing Material: Polyethylene Terephthalate (PET), Polyester; Operating Temperature: 0°C ~ 70°C; ComponentLink2URL: http://www.trpconnector.com/pdfs/6605728.pdf; ComponentLink2Description: http://www.trpconnector.com/pdfs/6605728.pdf; Supplier 1: Digi-Key; Stock 1: 1539206; Pricing 1: 1=0.1, 50=0.0196, 100=0.0149, 250=0.01104, 500=0.00816, 1000=0.00544, 2500=0.00459 (USD); Composition: Thick Film; Package / Case: 0805 (2012 Metric); Supplier Device Package: 0805; Size / Dimension: 0.079" L x 0.049" W (2.00mm x 1.25mm); Height: 0.028" (0.70mm); Number of Terminations: 2; ComponentLink3URL: http://industrial.panasonic.com/www-cgi/jvcr13pz.cgi?E+PZ+3+AOA0001+ERJ6GEY0R00V+7+WW; ComponentLink3Description: http://industrial.panasonic.com/www-cgi/jvcr13pz.cgi?E+PZ+3+AOA0001+ERJ6GEY0R00V+7+WW; Supplier Part Number 1: P0.0ACT-ND
R15 R16 = 1.2K: MULTICOMP - MCPWR05FTEW1201 - RESISTOR, 0805, 1.2K 1%,  0.125W; Tolerance: ±5%; Power (Watts): 0.125W, 1/8W; Temperature Coefficient: ±200ppm/°C; Manufacturer: MULTICOMP; Manufacturer Part Number: MCPWR05FTEW1201; RoHS: Y-EX; ComponentLink1URL: http://www.farnell.com/datasheets/1718729.pdf; ComponentLink1Description: http://www.farnell.com/datasheets/1718729.pdf; ComponentLink2URL: http://www.farnell.com/cad/1559081.zip; ComponentLink2Description: http://www.farnell.com/cad/1559081.zip; Supplier 1: Digi-Key; Category: Resistors; Stock 1: 47928; Pricing 1: 1=0.1, 10=0.021, 50=0.0116, 100=0.0088, 250=0.00652, 500=0.0048, 1000=0.0032, 2500=0.0027 (USD); Packaging: Cut Tape (CT); Resistance (Ohms): 1.2k; Composition: Thick Film; Features: -; Operating Temperature: -55°C ~ 155°C; Package / Case: 0805 (2012 Metric); Supplier Device Package: 0805; Size / Dimension: 0.079" L x 0.049" W (2.00mm x 1.25mm); Height: 0.026" (0.65mm); Number of Terminations: 2; ComponentLink3URL: http://www.seielect.com/Catalog/SEI-RMCF_RMCP.pdf; ComponentLink3Description: http://www.seielect.com/Catalog/SEI-RMCF_RMCP.pdf; Supplier Part Number 1: RMCF0805JT1K20CT-ND
R17 R18 = 4.7K,0805: BOURNS - CR0805-FX-4701GLF - RESISTOR, 4.7K, 0.125W, 1%; Product Range: BOURNS - CR Series; Resistance: 4.7; Power Rating: 125; Resistor Case Style: 0805 [2012 Metric]; Resistor Element Material: Thick Film; Temperature Coefficient: ± 100; Voltage Rating: 150; SVHC: No SVHC (16-Jun-2014); Resistor Mounting: SMD<!--FANDB--><div class="features-and-benefits-container"></div>; Tolerance: ±5%; Power (Watts): 0.125W, 1/8W; Supplier 1: Digi-Key; Manufacturer: BOURNS; Manufacturer Part Number: CR0805-FX-4701GLF; RoHS: YES; Stock 1: 1014866; Pricing 1: 1=0.1, 50=0.0196, 100=0.0149, 250=0.01104, 500=0.00816, 1000=0.00544, 2500=0.00459 (USD); Resistance Tolerance: ± 1%; Packaging: Cut Tape; MSL: MSL 1 - Unlimited; ComponentLink1URL: http://www.farnell.com/datasheets/1845293.pdf; ComponentLink1Description: http://www.farnell.com/datasheets/1845293.pdf; Supplier Part Number 1: P4.7KACT-ND; Category: Resistors; Resistance (Ohms): 4.7k; Composition: Thick Film; Features: Automotive AEC-Q200; Operating Temperature: -55°C ~ 155°C; Package / Case: 0805 (2012 Metric); Supplier Device Package: 0805; Size / Dimension: 0.079" L x 0.049" W (2.00mm x 1.25mm); Height: 0.028" (0.70mm); Number of Terminations: 2; ComponentLink2URL: http://industrial.panasonic.com/www-cgi/jvcr13pz.cgi?E+PZ+3+AOA0001+ERJ6GEYJ472V+7+WW; ComponentLink2Description: http://industrial.panasonic.com/www-cgi/jvcr13pz.cgi?E+PZ+3+AOA0001+ERJ6GEYJ472V+7+WW
U2 = AM335X_15mmx15mm: SubArctic Cortex A8 Processor 15x15; PartName: AM335X_15x15; Mfr: TI; MfrNum: AM335x 15x15 FBGA ZCE; TIIntPartnumber: 1A0242; Vendor: Arrow; Cost100: 10.00; Cost10K: 10.00; Supplier 1: Digi-Key